# Altium project PowerManagement_neg5V.PrjPcb
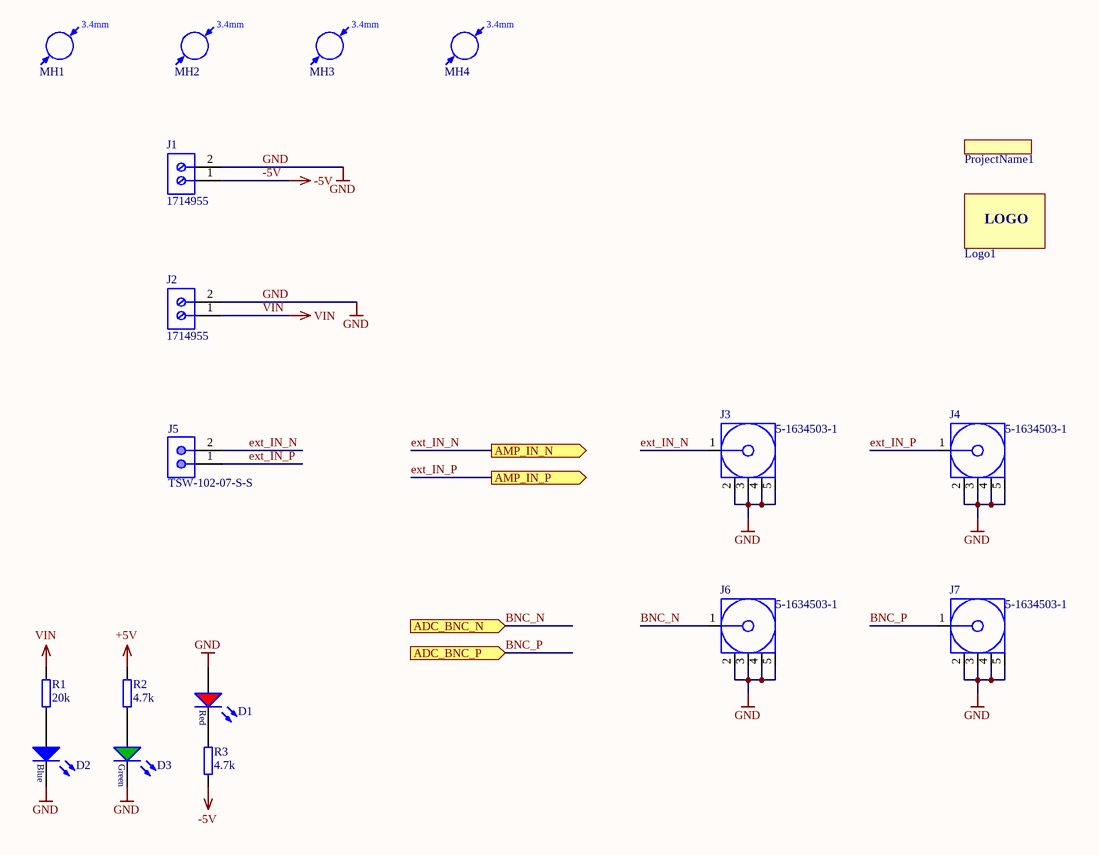
[diagram p0: PCBdesign.SchDoc]
Author: S.Lukas; Date: 06/20; ProjectAuthor: Simon Lukas; ProjectName: Power Supply -5V; ProjectRevision: 1v03
3 sheets, 107 parts. Net scope: flat (ports and power ports of the same name join across sheets).
Board file: PowerManagement_neg5V.PcbDoc
Sheets:
  PCBdesign.SchDoc
  PowerSupply.SchDoc
  Amplifier.SchDoc

## Sheet PCBdesign.SchDoc
size A4; Author: Eyke Liegmann; CompanyName: Technische Universität München; Address1: Arcisstr. 21; Address2: 80333 München; Address3: GERMANY; SheetNumber: 1; SheetTotal: 3; CompanyName2: TU München

### Parts
D1  150060RS75000  [WL-SMCW_0603]  (value not drawn)
D2  150060BS75000  [WL-SMCW_0603]  (value not drawn)
D3  150060GS75000  [WL-SMCW_0603]  (value not drawn)
J1  1714955  [PHOE-1714955_V]
J2  1714955  [PHOE-1714955_V]
J3  5-1634503-1  [TECO-5-1634503-1_V]
J4  5-1634503-1  [TECO-5-1634503-1_V]
J5  TSW-102-07-S-S  [SMTC-TSW-102-07-S-S]
J6  5-1634503-1  [TECO-5-1634503-1_V]
J7  5-1634503-1  [TECO-5-1634503-1_V]
Logo1  (no value)  [LOGO_Tum]
MH1  mounting hole 3,4mm  [MH_3.4]  (value not drawn)
MH2  mounting hole 3,4mm  [MH_3.4]  (value not drawn)
MH3  mounting hole 3,4mm  [MH_3.4]  (value not drawn)
MH4  mounting hole 3,4mm  [MH_3.4]  (value not drawn)
ProjectName1  Project Name, Rev  [ID_ProjectRev]  (value not drawn)  (no BOM)
R1  20k  [RESC1608X06N]
R2  4.7k  [RESC1608X06N]
R3  4.7k  [RESC1608X06N]

### Ports
ADC_BNC_N (in), ADC_BNC_P (in), AMP_IN_N (out), AMP_IN_P (out)

### Nets
+5V: R2.2
-5V: J1.1 R3.1
GND: D1.2(A) D2.1(K) D3.1(K) J1.2 J2.2 J3.2 J3.3 J3.4 J3.5 J4.2 J4.3 J4.4 J4.5 J6.2 J6.3 J6.4 J6.5 J7.2 J7.3 J7.4 J7.5
VIN: J2.1 R1.2  [project net conv_N]
BNC_N: J6.1 ; port ADC_BNC_N  [project net ADC_IN_N]
BNC_P: J7.1 ; port ADC_BNC_P  [project net ADC_IN_P]
ext_IN_N: J3.1 J5.2 ; port AMP_IN_N
ext_IN_P: J4.1 J5.1 ; port AMP_IN_P
NetD1_1: D1.1(K) R3.2
NetD2_2: D2.2(A) R1.1
NetD3_2: D3.2(A) R2.1

### Notes on the sheet
- Title
- Size:
- Date:
- A4
- Revision:
- Time:
- Sheet
- of
- Author:
- Project:
- (in symbol Logos) LOGO
- (in symbol Mounting Hole) 3.4mm

### Library data of the parts
D1 = LED_Red_0603: WL-SMCW SMD Mono-color Chip LED Waterclear, size 0603, Red, 2 V, 140°; Forward Voltage: 2 V; Luminous Intensity: 250 mcd; Peak Wavelength: 630 nm; Dominant Wavelength: 625 nm; MF: Wuerth Elektronik; Published Date: Sep. 2017; ComponentLink1Description: Manufacturer; ComponentLink1URL: http://www.we-online.de; ComponentLink2Description: Datasheet; ComponentLink2URL: http://katalog.we-online.com/led/datasheet/150060RS75000.pdf; MPN: 150060RS75000; Size: 0603; Viewing Angle: 140°; Emitting Color: Red; Value: 150060RS75000; Package: 0603; Created: 2018_09_06_AGeiger; Supplier 1: Farnell; Supplier Part Number 1: 2322071; Supplier 2: Mouser; Supplier Part Number 2: 710-150060RS75000; Supplier 3: Digi-Key; Supplier Part Number 3: 732-4978-1-ND
D2 = LED_Blue_0603: WL-SMCW SMD Mono-color Chip LED Waterclear, size 0603, Blue, 3.2 V, 140°; Forward Voltage: 3.2 V; Luminous Intensity: 145 mcd; Peak Wavelength: 465 nm; Dominant Wavelength: 470 nm; MF: Wuerth Elektronik; Published Date: Sep. 2017; ComponentLink1Description: Manufacturer; ComponentLink1URL: http://www.we-online.de; ComponentLink2Description: Datasheet; ComponentLink2URL: http://katalog.we-online.com/led/datasheet/150060BS75000.pdf; MPN: 150060BS75000; Size: 0603; Viewing Angle: 140°; Emitting Color: Blue; Value: 150060BS75000; Package: 0603; Created: 2018_09_06_AGeiger; Supplier 1: Farnell; Supplier Part Number 1: 2322069; Supplier 2: Mouser; Supplier Part Number 2: 710-150060BS75000; Supplier 3: Digi-Key; Supplier Part Number 3: 732-4966-1-ND
D3 = LED_Green_0603: WL-SMCW SMD Mono-color Chip LED Waterclear, size 0603, Green, 3.2 V, 140°; Forward Voltage: 3.2 V; Luminous Intensity: 430 mcd; Peak Wavelength: 515 nm; Dominant Wavelength: 520 nm; MF: Wuerth Elektronik; Published Date: Sep. 2017; ComponentLink1Description: Manufacturer; ComponentLink1URL: http://www.we-online.de; ComponentLink2Description: Datasheet; ComponentLink2URL: http://katalog.we-online.com/led/datasheet/150060GS75000.pdf; MPN: 150060GS75000; Size: 0603; Viewing Angle: 140°; Emitting Color: Green; Value: 150060GS75000; Package: 0603; Created: 2018_09_06_AGeiger; Supplier 1: Farnell; Supplier Part Number 1: 2322070; Supplier 2: Mouser; Supplier Part Number 2: 710-150060GS75000; Supplier 3: Digi-Key; Supplier Part Number 3: 732-4971-1-ND
J1 J2 = 1714955: Conn Terminal Blocks 2 POS 6.35mm Solder ST Thru-Hole 32A; Manufacturer: Phoenix Contact; Max Supply Voltage: 500V; Voltage Rating: 630V; Number of Poles: 2; Number of Levels: 1; Current: 30A; Voltage: 300V; Gender: Male; Connector Type: PCB,Terminal Block; Wire Gauge (Max): 24AWG; Wire Gauge (Min): 10AWG; Stripping Length: 8mm; Approvals: UL,CSA,cULus; Supplier 1: Mouser; Manufacturer Part Number: 1714955; RoHS: Yes; Category: Terminal Blocks; Stock 1: 477; Mount: Through Hole; Number of Pins: 2; Weight: 0.197534oz; Color: Green; Housing Material: Polyamide; Housing Color: Green; Material: Polyamide; Insulation Material: Nylon; Contact Material: Tin; Package Quantity: 50; Packaging: Bulk; Termination: Screw; Max Current Rating: 32A; Current Rating: 32A; Number of Rows: 1; Orientation: Straight; Number of Positions Per Level: 2; Number of Positions: 2; Number of Contacts: 2; Number of Circuits: 2; Length: 12.7mm; Height: 26.6mm; Width: 26.6mm; Pitch: 6.35mm; Depth: 12.5mm; Wire/Cable Gauge: 24AWG; Radiation Hardening: No; Lead Free: Lead Free; Flammability Rating: UL94 V-0; REACH SVHC: No SVHC; ComponentLink1URL: https://datasheet.ciiva.com/16071/1714955-16071953.pdf?src-supplier=Onlinecomponents.com; ComponentLink1Description: https://datasheet.ciiva.com/16071/1714955-16071953.pdf?src-supplier=Onlinecomponents.com; ComponentLink2URL: https://datasheet.ciiva.com/824/1714955-824307.pdf?src-supplier=Digi-Key; ComponentLink2Description: https://datasheet.ciiva.com/824/1714955-824307.pdf?src-supplier=Digi-Key; ComponentLink3URL: https://datasheet.ciiva.com/1120/100944-1120389.pdf?src-supplier=Farnell; ComponentLink3Description: https://datasheet.ciiva.com/1120/100944-1120389.pdf?src-supplier=Farnell; ComponentLink4URL: https://datasheet.ciiva.com/15169/getdatasheetpartid-177883-15169653.pdf?src-supplier=Verical; ComponentLink4Description: https://datasheet.ciiva.com/15169/getdatasheetpartid-177883-15169653.pdf?src-supplier=Verical; ComponentLink5URL: https://datasheet.ciiva.com/1118/100944-1118422.pdf?src-supplier=Element14; ComponentLink5Description: https://datasheet.ciiva.com/1118/100944-1118422.pdf?src-supplier=Element14; ComponentLink6URL: https://datasheet.ciiva.com/14607/70054427-14607514.pdf?src-supplier=Allied+Electronics; ComponentLink6Description: https://datasheet.ciiva.com/14607/70054427-14607514.pdf?src-supplier=Allied+Electronics; ComponentLink7URL: https://datasheet.ciiva.com/29218/744545-da-01-en-printklemme-mkds-5-2-6-35-29218282.pdf?src-supplier=Conrad; ComponentLink7Description: https://datasheet.ciiva.com/29218/744545-da-01-en-printklemme-mkds-5-2-6-35-29218282.pdf?src-supplier=Conrad; Supplier Part Number 1: 651-1714955
J3 J4 J6 J7 = 5-1634503-1: BNC Str PCB Skt 50Ohm Nickel Pltd; Manufacturer: TE Connectivity; Dielectric Material: Polymethylpentene; Body Material: Zinc; Impedance: 50R; Frequency: 4GHz; Gender: Female; Connector Type: BNC,Jack; Insulation Resistance: 5GR; Number of Positions: 1; PCB Mount Retention: With; Sealable: No (Without); Connector System: Cable-to-Board; Polarity: Standard,Normal; PCB Thickness: 0.126inch; Tail Length: 0.177inch; Supplier 1: Mouser; Manufacturer Part Number: 5-1634503-1; RoHS: Yes; Category: RF / Coaxial Connectors; Stock 1: 5615; Mount: Through Hole,PCB; Contact Material: Bronze; Contact Plating: Gold; Insulation Material: Polymethylpentene; Body Plating: Nickel; Min Operating Temperature: -67°C; Max Operating Temperature: 185°C; Orientation: Straight; Termination: Solder; Packaging: Box; Package Quantity: 100; Fastening Type: Bayonet; Max Frequency: 4GHz; Length: 13.7mm; Depth: 11mm; Radiation Hardening: No; ELV: Compliant; REACH SVHC: No SVHC; ComponentLink1URL: https://datasheet.ciiva.com/9421/eng-cd-1634503-c-9421987.pdf?src-supplier=Avnet; ComponentLink1Description: https://datasheet.ciiva.com/9421/eng-cd-1634503-c-9421987.pdf?src-supplier=Avnet; ComponentLink2URL: https://datasheet.ciiva.com/642/eng-cd-1634503-e-642757.pdf?src-supplier=Digi-Key; ComponentLink2Description: https://datasheet.ciiva.com/642/eng-cd-1634503-e-642757.pdf?src-supplier=Digi-Key; ComponentLink3URL: https://datasheet.ciiva.com/30141/eng-cd-1634503-c-30141260.pdf?src-supplier=Onlinecomponents.com; ComponentLink3Description: https://datasheet.ciiva.com/30141/eng-cd-1634503-c-30141260.pdf?src-supplier=Onlinecomponents.com; ComponentLink4URL: https://datasheet.ciiva.com/11762/0900766b806ccb99-11762655.pdf?src-supplier=RSComponents; ComponentLink4Description: https://datasheet.ciiva.com/11762/0900766b806ccb99-11762655.pdf?src-supplier=RSComponents; ComponentLink5URL: https://datasheet.ciiva.com/1448/1663562-1448576.pdf?src-supplier=Element14; ComponentLink5Description: https://datasheet.ciiva.com/1448/1663562-1448576.pdf?src-supplier=Element14; ComponentLink6URL: https://datasheet.ciiva.com/16652/eng-cd-1634503-c-16652893.pdf?src-supplier=Avnet+Europe; ComponentLink6Description: https://datasheet.ciiva.com/16652/eng-cd-1634503-c-16652893.pdf?src-supplier=Avnet+Europe; Supplier Part Number 1: 571-5-1634503-1
J5 = TSW-102-07-S-S: SAMTEC         TSW-102-07-S-S             CONNECTOR, HEADER, 2 POSITION, 1ROW, 2.54MM; Number of Contacts: 2; Gender: Male; Connector Type: Male Pin; Max Current Rating: 7.6A; Max Voltage Rating (AC): 550V; Supplier 1: Mouser; Manufacturer: Samtec; Manufacturer Part Number: TSW-102-07-S-S; RoHS: Yes; Category: Headers and Wire Housings; Stock 1: 9923; Mount: Through Hole; Contact Material: Bronze; Housing Material: Polyester; Contact Plating: Gold; Color: Black; Housing Color: Black; Min Operating Temperature: -55°C; Max Operating Temperature: 125°C; Packaging: Bulk; Number of Rows: 1; Termination: Solder; Number of Positions: 2; Orientation: Straight; Package Quantity: 1; Length: 5.08mm; Pitch: 2.54mm; Depth: 2.54mm; Contact Mating Length: 0.23inch; Width: 2.54mm; Radiation Hardening: No; REACH SVHC: No SVHC; Lead Free: Lead Free; ComponentLink1URL: https://datasheet.ciiva.com/28366/1796313-28366300.pdf?src-supplier=Element14; ComponentLink1Description: https://datasheet.ciiva.com/28366/1796313-28366300.pdf?src-supplier=Element14; ComponentLink2URL: https://datasheet.ciiva.com/16734/htsw-th-16734222.pdf?src-supplier=Avnet+Europe; ComponentLink2Description: https://datasheet.ciiva.com/16734/htsw-th-16734222.pdf?src-supplier=Avnet+Europe; Supplier Part Number 1: 200-TSW10207SS
Logo1 = Logos
MH1-MH4 = Mounting Hole: Non plated through hole, 3.4mm
ProjectName1 = ID_ProjectRev: Project Name and Revision Number; Created: 2018_11_23_AGeiger; Value: Project Name, Rev
R1 = R_0603: MPN: Vishay / Dale; MF: CRCW060320K0JNEAC; Value: 20k; Supplier 1: Mouser; Supplier Part Number 1: 71-CRCW060320K0JNEAC; Package: 0603
R2 R3 = R_0603: MPN: CRCW06034K70JNEAC; MF: Vishay / Dale; Value: 4.7k; Supplier 1: Mouser; Supplier Part Number 1: 71-CRCW06034K70JNEAC; Package: 0603

## Sheet PowerSupply.SchDoc
size A4; Author: Eyke Liegmann; CompanyName: Technische Universität München; Address1: Arcisstr. 21; Address2: 80333 München; Address3: GERMANY; SheetNumber: 2; SheetTotal: 3; CompanyName2: TU München
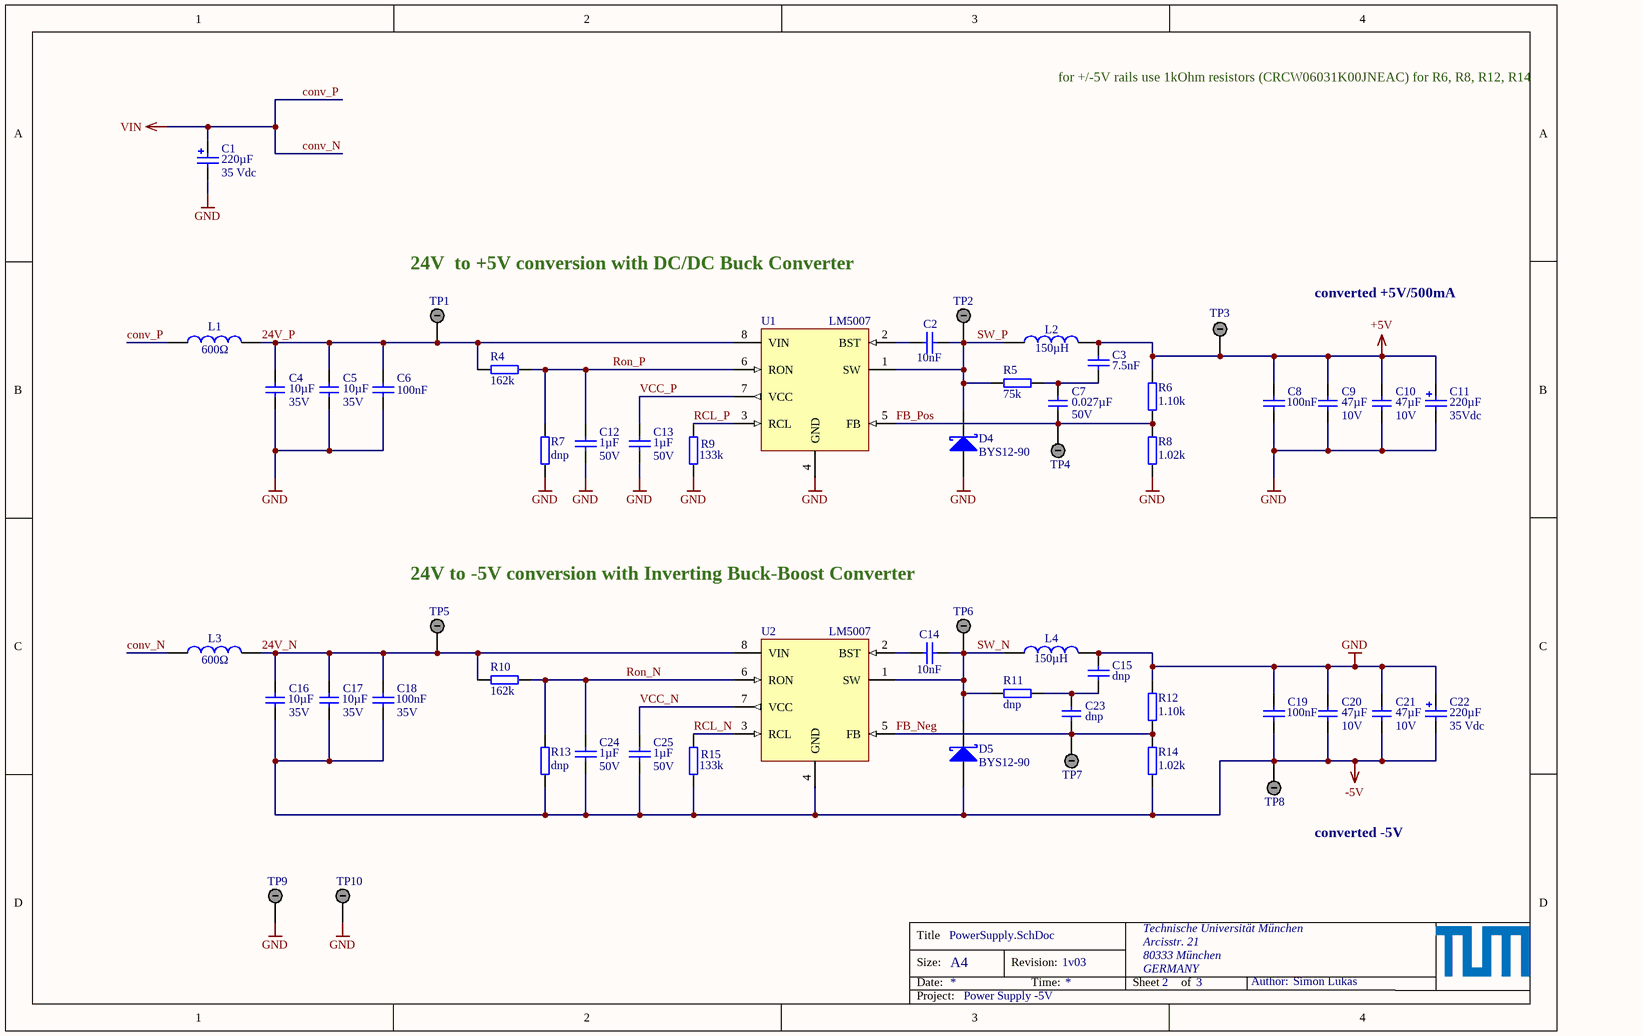
[diagram p1: PowerSupply.SchDoc]

### Parts
C1  220µF  Voltage: 35 Vdc  [WCAP-ATG5_8x11.5x3.5]
C2  10nF  [CAPC1608X07N]
C3  7.5nF  [CAPC1608X07N]
C4  10µF  Voltage: 35V  [C_1206]
C5  10µF  Voltage: 35V  [C_1206]
C6  100nF  [CAPC1608X07N]
C7  0.027µF  Voltage: 50V  [C_1206]
C8  100nF  [CAPC1608X07N]
C9  47µF  Voltage: 10V  [C_1206]
C10  47µF  Voltage: 10V  [C_1206]
C11  220µF  Voltage: 35Vdc  [WCAP-ATG5_8x11.5x3.5]
C12  1µF  Voltage: 50V  [CAPC1608X07N]
C13  1µF  Voltage: 50V  [CAPC1608X07N]
C14  10nF  [CAPC1608X07N]
C15  dnp  [CAPC1608X07N]
C16  10µF  Voltage: 35V  [C_1206]
C17  10µF  Voltage: 35V  [C_1206]
C18  100nF  Voltage: 35V  [CAPC1608X07N]
C19  100nF  [CAPC1608X07N]
C20  47µF  Voltage: 10V  [C_1206]
C21  47µF  Voltage: 10V  [C_1206]
C22  220µF  Voltage: 35 Vdc  [WCAP-ATG5_8x11.5x3.5]
C23  dnp  [C_1206]
C24  1µF  Voltage: 50V  [CAPC1608X07N]
C25  1µF  Voltage: 50V  [CAPC1608X07N]
D4  BYS12-90  [DIOM4227X23N]
D5  BYS12-90  [DIOM4227X23N]
L1  600Ω  [WE-CBF_0805_High Current]
L2  150µH  [SMT_inductor_1050_Performance]
L3  600Ω  [WE-CBF_0805_High Current]
L4  150µH  [SMT_inductor_1050_Performance]
R4  162k  [RESC1608X06N]
R5  75k  [RESC1608X06N]
R6  1.10k  [RESC1608X06N]
R7  dnp  [RESC1608X06N]
R8  1.02k  [RESC1608X06N]
R9  133k  [RESC1608X06N]
R10  162k  [RESC1608X06N]
R11  dnp  [RESC1608X06N]
R12  1.10k  [RESC1608X06N]
R13  dnp  [RESC1608X06N]
R14  1.02k  [RESC1608X06N]
R15  133k  [RESC1608X06N]
TP1  24V_P  [TP_5006]  (value not drawn)
TP2  SW_P  [TP_5006]  (value not drawn)
TP3  +5V  [TP_5006]  (value not drawn)
TP4  FB_P  [TP_5006]  (value not drawn)
TP5  24V_N  [TP_5006]  (value not drawn)
TP6  SW_N  [TP_5006]  (value not drawn)
TP7  FB_N  [TP_5006]  (value not drawn)
TP8  -5V  [TP_5006]  (value not drawn)
TP9  GND  [TP_5006]  (value not drawn)
TP10  GND  [TP_5006]  (value not drawn)
U1  LM5007  [TSOP65P490X110-8N]
U2  LM5007  [TSOP65P490X110-8N]

### Nets
+5V: C3.1 C8.2 C9.2 C10.2 C11.1(P) L2.2 R6.2 TP3.1
-5V: C16.1 C17.1 C18.2 C19.1 C20.1 C21.1 C22.2(N) C24.2 C25.2 D5.2(A) R13.1 R14.2 R15.1 TP8.1 U2.4(GND)
conv_N: C1.1(P) L1.1 L3.1  [also labelled conv_P, VIN]
GND: C1.2(N) C4.1 C5.1 C6.2 C8.1 C9.1 C10.1 C11.2(N) C12.2 C13.2 C15.1 C19.2 C20.2 C21.2 C22.1(P) D4.2(A) L4.2 R7.1 R8.1 R9.1 R12.1 TP9.1 TP10.1 U1.4(GND)
24V_N: C16.2 C17.2 C18.1 L3.2 R10.2 TP5.1 U2.8(VIN)
24V_P: C4.2 C5.2 C6.1 L1.2 R4.1 TP1.1 U1.8(VIN)
FB_Neg: C23.2 R12.2 R14.1 TP7.1 U2.5(FB)
FB_Pos: C7.1 R6.1 R8.2 TP4.1 U1.5(FB)
RCL_N: R15.2 U2.3(RCL)
RCL_P: R9.2 U1.3(RCL)
Ron_N: C24.1 R10.1 R13.2 U2.6(RON)
Ron_P: C12.1 R4.2 R7.2 U1.6(RON)
SW_N: C14.1 D5.1(K) L4.1 R11.2 TP6.1 U2.1(SW)
SW_P: C2.2 D4.1(K) L2.1 R5.1 TP2.1 U1.1(SW)
VCC_N: C25.1 U2.7(VCC)
VCC_P: C13.1 U1.7(VCC)
NetC2_1: C2.1 U1.2(BST)
NetC3_2: C3.2 C7.2 R5.2
NetC14_2: C14.2 U2.2(BST)
NetC15_2: C15.2 C23.1 R11.1

### Notes on the sheet
- for +/-5V rails use 1kOhm resistors (CRCW06031K00JNEAC) for R6, R8, R12, R14
- (near TP1) 24V  to +5V conversion with DC/DC Buck Converter
- converted +5V/500mA
- 24V to -5V conversion with Inverting Buck-Boost Converter
- converted -5V
- Title
- Size:
- Date:
- A4
- Revision:
- Time:
- Sheet
- of
- Author:
- Project:

### Library data of the parts
C1 C11 C22 = 860020574012: WCAP-ATG5 Aluminum Electrolytic Capacitors, 8x11.5mm, 35 Vdc, 220 uF; MF: Würth Elektronik; ComponentLink1Description: Manufacturer; ComponentLink1URL: http://www.we-online.de; ComponentLink2Description: Datasheet; ComponentLink2URL: http://katalog.we-online.com/pbs/datasheet/860020574012.pdf; Part Number: 860020574012; Size: 8x11.5mm; Life Cycle: 2000h; Operating Temperature: -40 °C up to +105 °C; Value: 220 µF; MPN: 860020574012; Supplier 1: Mouser; Supplier Part Number 1: 710-860020574012
C2 C14 = Cap_0603: MPN: 885012206065; MF: Würth Elektronik; Voltage: 25V; Dielectric: X7R; Value: 10nF; Supplier 1: Mouser; Supplier 2: Digi-Key; Supplier Part Number 1: 710-885012206065; Supplier Part Number 2: 732-7983-1-ND; Package: 0603
C3 = Cap_0603: MPN: C0603C752J3GACTU; MF: KEMET; Voltage: 25V; Dielectric: C0G; Tolerance: 5%; Value: 7.5nF; Supplier 1: Mouser; Supplier 2: *; Supplier Part Number 1: 80-C0603C752J3GACTU; Supplier Part Number 2: *; Package: 0603
C4 C5 C16 C17 = C_1206: Capacitor 1206; MPN: GRT31CC8YA106KE01L; Tolerance: 10%; MF: Murata Electronics; Dielectric: X6S; Package: 1206; Value: 10µF; Supplier 1: Mouser; Supplier Part Number 1: 81-GRT31CC8YA106KE1L
C6 = Cap_0603: MPN: 885012206071; MF: Würth Elektronik; Voltage: 25V; Dielectric: X7R; Value: 100nF; Supplier 1: Mouser; Supplier 2: Digi-Key; Supplier Part Number 1: 710-885012206071; Supplier Part Number 2: 732-7989-1-ND; Package: 0603
C7 = C_1206: Capacitor 1206; MPN: GRM3195C1H273JA01D; Tolerance: 5%; MF: Murata Electronics; Dielectric: C0G; Package: 1206; Value: 0.027µF; Supplier 1: Mouser; Supplier Part Number 1: 81-GRM315C1H273JA01D
C8 C19 = Cap_0603: MPN: 885012206071; MF: Würth Elektronik; Voltage: 25V; Dielectric: X7R; Tolerance: 10%; Value: 100nF; Supplier 1: Mouser; Supplier 2: *; Supplier Part Number 1: 710-885012206071; Supplier Part Number 2: *; Package: 0603
C9 C10 C20 C21 = C_1206: Capacitor 1206; MPN: GRM31CR61A476ME15L; Tolerance: 20%; MF: Murata Electronics; Dielectric: X5R; Package: 1206; Value: 47µF; Supplier 1: Mouser; Supplier Part Number 1: 81-GRM31CR61A476ME5L
C12 C13 C24 C25 = Cap_0603: MPN: GRT188R61H105KE13D; MF: Murata Electronics; Dielectric: X5R; Value: 1µF; Supplier 1: Mouser; Supplier 2: Digi-Key; Supplier Part Number 1: 81-GRT188R61H105KE3D; Supplier Part Number 2: 490-12330-1-ND; Package: 0603
C15 = Cap_0603: MPN: C0603C752J3GACTU; possibleValue: 7.5nF; MF: KEMET; Voltage: 25V; Dielectric: C0G; Tolerance: 5%; Supplier 1: Mouser; Supplier 2: *; Supplier Part Number 1: 80-C0603C752J3GACTU; Supplier Part Number 2: *; Package: 0603; Value: dnp
C18 = Cap_0603: MPN: GMK107B7104KAHT; MF: Taiyo Yuden; Tolerance: 10%; Dielectric: X7R; Value: 100nF; Supplier 1: Mouser; Supplier 2: Digi-Key; Supplier Part Number 1: 963-GMK107B7104KAHT; Supplier Part Number 2: 587-3354-1-ND; Package: 0603
C23 = C_1206: Capacitor 1206; MPN: GRM3195C1H273JA01D; possibleValue: 0.027µF; Tolerance: 5%; MF: Murata Electronics; Dielectric: C0G; Voltage: 50V; Package: 1206; Supplier 1: Mouser; Supplier Part Number 1: 81-GRM315C1H273JA01D; Value: dnp
D4 D5 = BYS12-90: Schottky Diode; MPN: BYS12-90-E3/TR3; MF: Vishay; Forward Voltage: 750mV; Reverse Voltage: 90V; Rated Current: 1.5A; Package: DO-214AC; Supplier 1: Farnell; Supplier 2: Mouser; Supplier 3: Digi-Key; Supplier Part Number 1: 2889144; Supplier Part Number 2: 625-BYS12-90-E3/TR3; Supplier Part Number 3: BYS12-90-E3/GICT-ND
L1 L3 = WE-CBF, 742792040: WE-CBF SMD EMI Suppression Ferrite Bead, 0805, 600Ω; MF: Würth Elektronik; Type: High Current; ComponentLink1Description: Manufacturer; ComponentLink1URL: http://www.we-online.de; ComponentLink2Description: Datasheet; ComponentLink2URL: http://katalog.we-online.de/pbs/datasheet/742792040.pdf; MPN: 742792040; Value: 600Ω; Size: 0805; Supplier 1: Farnell; Supplier 2: Mouser; Supplier 3: Digi-Key; Supplier Part Number 2: 710-742792040; Supplier Part Number 3: 732-1620-1-ND
  L1: Supplier Part Number 1: 2761567
  L3: Supplier Part Number 1: 1635735
L2 L4 = B82464G4154M: SMT power Inductor, 150uH, 320m DRC; MF: EPCOS / TDK; Rated Current: 0.85 A; Tolerance: 20%; MPN: B82464G4154M; Supplier 1: Mouser; Supplier Part Number 1: 871-B82464G4154M; Value: 150µH; DCR: 320m
R4 R10 = R_0603: MPN: CR0603-FX-1623ELF; MF: Bourns; Value: 162k; Supplier 1: Mouser; Supplier Part Number 1: 652-CR0603-FX1623ELF; Package: 0603
R5 = R_0603: MPN: AC0603FR-1375KL; MF: Yageo; Value: 75k; Supplier 1: Mouser; Supplier Part Number 1: 603-AC0603FR-1375KL; Package: 0603
R6 R12 = R_0603: MPN: CRCW06031K10JNEAC; MF: Vishay / Dale; Tolerance: 5%; Value: 1.10k; Supplier 1: Mouser; Supplier Part Number 1: 71-CRCW06031K10JNEAC; Package: 0603
R7 R13 = R_0603: Value: dnp; Package: 0603
R8 R14 = R_0603: MPN: CR0603-FX-1021ELF; MF: Bourns; Tolerance: 1%; Value: 1.02k; Supplier 1: Mouser; Supplier Part Number 1: 652-CR0603FX-1021ELF; Package: 0603
R9 R15 = R_0603: MPN: CR0603-FX-1333ELF; MF: Bourns; Value: 133k; Supplier 1: Mouser; Supplier Part Number 1: 652-CR0603FX-1333ELF; Package: 0603
R11 = R_0603: MPN: AC0603FR-1375KL; possibleValue: 75k; MF: Yageo; Supplier 1: Mouser; Supplier Part Number 1: 603-AC0603FR-1375KL; Package: 0603; Value: dnp
TP1-TP10 = 5006: Test Point;  Compact;  THM;  PC;  .350 L;  .125 OD;  Heat Resistant Nylon 46;  Black; Manufacturer: Keystone Electronics; Body Material: PBT; Plating: Silver; Number of Ports: 1; Outside Diameter: 3.18mm; Inside Diameter: 1.78mm; Hole Diameter: 1.6mm; Supplier 1: Mouser; Manufacturer Part Number: 5006; RoHS: Yes; Category: Connectors; Stock 1: 203116; Mount: PCB,Through Hole; Material: Nylon,Bronze,Silver; Contact Material: Bronze; Contact Plating: Tin,Silver; Color: Black; Housing Color: Black; Package Quantity: 100; Packaging: Bulk; Orientation: Straight; Length: 8.89mm; Height: 0.35inch; Lead Free: Lead Free; REACH SVHC: No SVHC; Flammability Rating: UL94 V-0; ComponentLink1URL: https://datasheet.ciiva.com/1123/m60-2p60-1123808.pdf?src-supplier=Newark; ComponentLink1Description: https://datasheet.ciiva.com/1123/m60-2p60-1123808.pdf?src-supplier=Newark; ComponentLink2URL: https://datasheet.ciiva.com/1454/1718283-1454829.pdf?src-supplier=Element14; ComponentLink2Description: https://datasheet.ciiva.com/1454/1718283-1454829.pdf?src-supplier=Element14; ComponentLink3URL: https://datasheet.ciiva.com/11744/0900766b8009b7c7-11744947.pdf?src-supplier=RSComponents; ComponentLink3Description: https://datasheet.ciiva.com/11744/0900766b8009b7c7-11744947.pdf?src-supplier=RSComponents; ComponentLink4URL: https://datasheet.ciiva.com/2917/m60-2p60-2917629.pdf?src-supplier=Digi-Key; ComponentLink4Description: https://datasheet.ciiva.com/2917/m60-2p60-2917629.pdf?src-supplier=Digi-Key; ComponentLink5URL: https://datasheet.ciiva.com/16883/70182825-16883963.pdf?src-supplier=Allied+Electronics; ComponentLink5Description: https://datasheet.ciiva.com/16883/70182825-16883963.pdf?src-supplier=Allied+Electronics; Supplier Part Number 1: 534-5006
U1 U2 = LM5007: Buck Converter, 9-75Vin, 2.5-73Vout; MPN: LM5007MM/NOPB; MF: Texas Instruments; Supplier 1: Farnell; Supplier 2: Mouser; Supplier 3: Digi-Key; Supplier Part Number 1: 3007210; Supplier Part Number 2: 926-LM5007MM/NOPB; Supplier Part Number 3: 296-LM5007MM/NOPBCT-ND; Package: VSSOP-8

## Sheet Amplifier.SchDoc
size A4; Author: Eyke Liegmann; CompanyName: Technische Universität München; Address1: Arcisstr. 21; Address2: 80333 München; Address3: GERMANY; SheetNumber: 3; SheetTotal: 3; CompanyName2: TU München
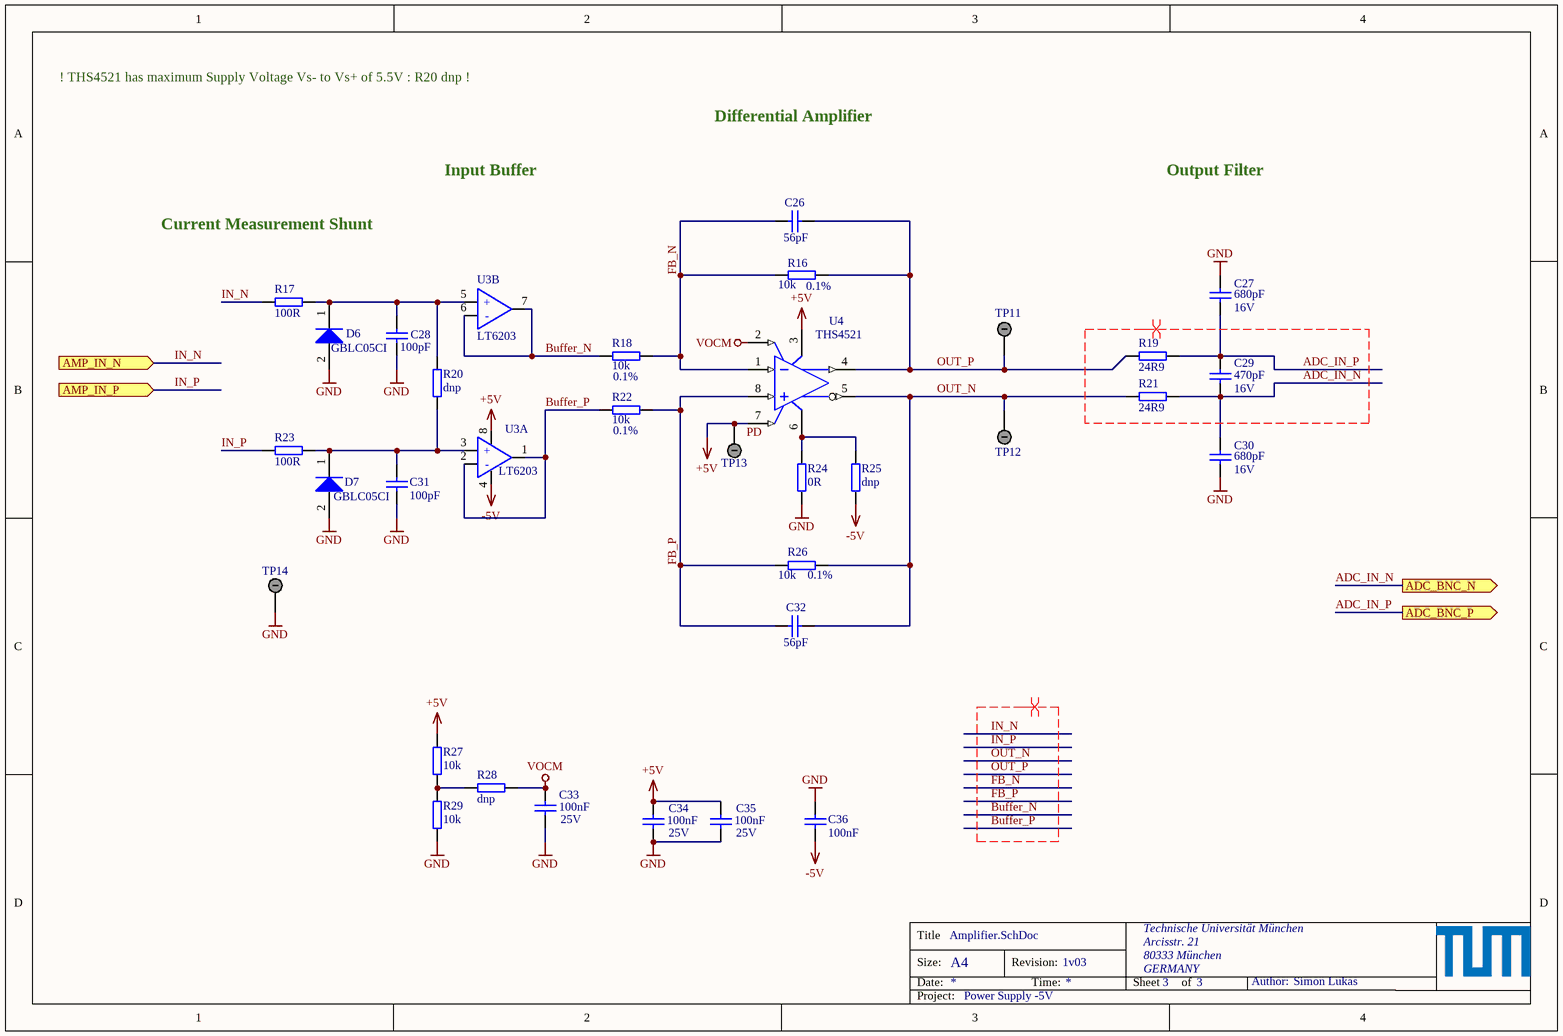
[diagram p2: Amplifier.SchDoc]

### Parts
C26  56pF  [CAPC1608X07N]
C27  680pF  Voltage: 16V  [CAPC1608X07N]
C28  100pF  [CAPC1608X07N]
C29  470pF  Voltage: 16V  [CAPC1608X07N]
C30  680pF  Voltage: 16V  [CAPC1608X07N]
C31  100pF  [CAPC1608X07N]
C32  56pF  [CAPC1608X07N]
C33  100nF  Voltage: 25V  [CAPC1608X07N]
C34  100nF  Voltage: 25V  [CAPC1608X07N]
C35  100nF  Voltage: 25V  [CAPC1608X07N]
C36  100nF  [CAPC1608X07N]
D6  GBLC05CI  [SOD-323_SuppressorDiode]
D7  GBLC05CI  [SOD-323_SuppressorDiode]
R16  10k  Tolerance: 0.1%  [RESC1608X06N]
R17  100R  [RESC1608X06N]
R18  10k  Tolerance: 0.1%  [RESC1608X06N]
R19  24R9  [RESC1608X06N]
R20  dnp  [RESC3216X65N]
R21  24R9  [RESC1608X06N]
R22  10k  Tolerance: 0.1%  [RESC1608X06N]
R23  100R  [RESC1608X06N]
R24  0R  [RESC1608X06N]
R25  dnp  [RESC1608X06N]
R26  10k  Tolerance: 0.1%  [RESC1608X06N]
R27  10k  [RESC1608X06N]
R28  dnp  [RESC1608X06N]
R29  10k  [RESC1608X06N]
TP11  AMP+  [TP_5006]  (value not drawn)
TP12  AMP-  [TP_5006]  (value not drawn)
TP13  PD  [TP_5006]  (value not drawn)
TP14  GND  [TP_5006]  (value not drawn)
U3  LT6203  [MSOP8_3x3-8N]  (parts A,B of 2)
U4  THS4521  [DGK0008A_N]

### Ports
ADC_BNC_N (out), ADC_BNC_P (out), AMP_IN_N (in), AMP_IN_P (in)

### Nets
+5V: C34.1 C35.1 R27.1 TP13.1 U3.8 U4.3(VS+) U4.7(~{PD})
-5V: C36.2 R25.1 U3.4
GND: C27.1 C28.2 C30.2 C31.2 C33.2 C34.2 C35.2 C36.1 D6.2(A) D7.2(A) R24.1 R29.2 TP14.1
VOCM: C33.1 R28.1 U4.2(VOCM)
ADC_IN_N: C29.2 C30.1 R21.2 ; port ADC_BNC_N
ADC_IN_P: C27.2 C29.1 R19.2 ; port ADC_BNC_P
Buffer_N: R18.1 U3.6(-) U3.7
Buffer_P: R22.1 U3.1 U3.2(-)
FB_N: C26.1 R16.1 R18.2 U4.1(VIN-)
FB_P: C32.1 R22.2 R26.1 U4.8(VIN+)
IN_N: R17.1 ; port AMP_IN_N  [project net ext_IN_N]
IN_P: R23.1 ; port AMP_IN_P  [project net ext_IN_P]
OUT_N: C32.2 R21.1 R26.2 TP12.1 U4.5(VOUT-)
OUT_P: C26.2 R16.2 R19.1 TP11.1 U4.4(VOUT+)
NetC28_1: C28.1 D6.1(K) R17.2 R20.2 U3.5(+)
NetC31_1: C31.1 D7.1(K) R20.1 R23.2 U3.3(+)
NetR24_2: R24.2 R25.2 U4.6(VS-)
NetR27_2: R27.2 R28.2 R29.1

### Layout directives
differential pair: ADC_IN_N, ADC_IN_P, Buffer_N, Buffer_P, FB_N, FB_P, IN_N, IN_P, OUT_N, OUT_P

### Notes on the sheet
- ! THS4521 has maximum Supply Voltage Vs- to Vs+ of 5.5V : R20 dnp !
- Input Buffer
- Differential Amplifier
- Output Filter
- Current Measurement Shunt
- Labels drawn without touching a wire or pin: PD
- Title
- Size:
- Date:
- A4
- Revision:
- Time:
- Sheet
- of
- Author:
- Project:

### Library data of the parts
C26 C32 = Cap_0603: MPN: VJ0603A560JXACW1BC; MF: Vishay; Voltage: 50V; Dielectric: C0G; Value: 56pF; Supplier 1: Mouser; Supplier 2: *; Supplier Part Number 1: 77-VJ0603A560JXACBC; Supplier Part Number 2: *; Package: 0603
C27 C30 = Cap_0603: MPN: VJ0603A681GXJCW1BC; MF: Vishay; Dielectric: C0G; Value: 680pF; Supplier 1: Mouser; Supplier 2: *; Supplier Part Number 1: 77-VJ0603A681GXJCBC; Supplier Part Number 2: *; Package: 0603
C28 C31 = Cap_0603: MPN: 885012006057; MF: Würth Elektronik; Voltage: 50V; Value: 100pF; Supplier 1: Mouser; Supplier 2: *; Supplier Part Number 1: 710-885012006057; Supplier Part Number 2: *
C29 = Cap_0603: MPN: VJ0603A471JXJCW1BC; MF: Vishay; Dielectric: C0G; Value: 470pF; Supplier 1: Mouser; Supplier 2: *; Supplier Part Number 1: 77-VJ0603A471JXJCBC; Supplier Part Number 2: *; Package: 0603
C33-C35 = Cap_0603: MPN: 885012206071; MF: Würth Elektronik; Dielectric: X7R; Value: 100nF; Supplier 1: Mouser; Supplier 2: *; Supplier Part Number 1: 710-885012206071; Supplier Part Number 2: *; Package: 0603
C36 = Cap_0603: as C6 on sheet PowerSupply; Value: 100nF; Supplier 1: Mouser; Supplier 2: *; Supplier Part Number 1: 710-885012206071; Supplier Part Number 2: *; Package: 0603
D6 D7 = GBLCxx: Ultra Low Capacitance TVS Array; MPN: GBLC05CI-LF-T7; MF: ProTek Devices; standoff voltage: 5.0V; breakdown voltage: 6.0V; Package: SOD-323; Supplier 1: arrow; Supplier 2: futureelectronics; Supplier Part Number 1: *; Supplier Part Number 2: *; Model: GBLC05CI; ComponentLink1Description: Datasheet; ComponentLink1URL: https://static6.arrow.com/aropdfconversion/cf1b73a38d87e210bfa153441e03466b149f09ba/gblci.pdf
R16 R18 R22 R26 = R_0603: MPN: RE0603BRE0710KL; MF: Yageo; Value: 10k; Supplier 1: Mouser; Supplier Part Number 1: 603-RE0603BRE0710KL; Package: 0603
R17 R23 = R_0603: MPN: AC0603FR-13100RL; MF: Yageo; Tolerance: 1%; Value: 100R; Supplier 1: Mouser; Supplier Part Number 1: 603-AC0603FR-13100RL; Package: 0603
R19 R21 = R_0603: MPN: RC0603FR-1324R9L; MF: Yageo; Value: 24R9; Supplier 1: Mouser; Supplier Part Number 1: 603-RC0603FR-1324R9L; Package: 0603
R20 = R_1206: WID SMD 1M 5% 0,25W; MPN: APC1206B200RN; AN: 22757; possibleValue: 200R; Mixed: SMT; Preferred: Yes; MF: ARCOL/Ohmite; Case: 1206; Technology: TK100; Tolerance: 5%; Supplier 1: Mouser; Supplier Part Number 1: 284-APC1206B200RN; Value: dnp
R24 = R_0603: MPN: CRCW06030000Z0EBC; MF: Vishay / Dale; Value: 0R; Supplier 1: Mouser; Supplier Part Number 1: 71-CRCW06030000Z0EBC; Package: 0603
R25 R28 = R_0603: Value: dnp; Package: 0603
R27 R29 = R_0603: MPN: CRCW060310K0FKEAC; MF: Vishay / Dale; Value: 10k; Supplier 1: Mouser; Supplier Part Number 1: 71-CRCW060310K0FKEAC; Package: 0603
TP11-TP14 = 5006: as TP1 on sheet PowerSupply; Supplier 1: Mouser; Manufacturer Part Number: 5006; RoHS: Yes; Category: Connectors; Stock 1: 203116; Mount: PCB,Through Hole; Material: Nylon,Bronze,Silver; Contact Material: Bronze; Contact Plating: Tin,Silver; Color: Black; Housing Color: Black; Package Quantity: 100; Packaging: Bulk; Orientation: Straight; Length: 8.89mm; Height: 0.35inch; Lead Free: Lead Free; REACH SVHC: No SVHC; Flammability Rating: UL94 V-0; ComponentLink1URL: https://datasheet.ciiva.com/1123/m60-2p60-1123808.pdf?src-supplier=Newark; ComponentLink1Description: https://datasheet.ciiva.com/1123/m60-2p60-1123808.pdf?src-supplier=Newark; ComponentLink2URL: https://datasheet.ciiva.com/1454/1718283-1454829.pdf?src-supplier=Element14; ComponentLink2Description: https://datasheet.ciiva.com/1454/1718283-1454829.pdf?src-supplier=Element14; ComponentLink3URL: https://datasheet.ciiva.com/11744/0900766b8009b7c7-11744947.pdf?src-supplier=RSComponents; ComponentLink3Description: https://datasheet.ciiva.com/11744/0900766b8009b7c7-11744947.pdf?src-supplier=RSComponents; ComponentLink4URL: https://datasheet.ciiva.com/2917/m60-2p60-2917629.pdf?src-supplier=Digi-Key; ComponentLink4Description: https://datasheet.ciiva.com/2917/m60-2p60-2917629.pdf?src-supplier=Digi-Key; ComponentLink5URL: https://datasheet.ciiva.com/16883/70182825-16883963.pdf?src-supplier=Allied+Electronics; ComponentLink5Description: https://datasheet.ciiva.com/16883/70182825-16883963.pdf?src-supplier=Allied+Electronics; Supplier Part Number 1: 534-5006
U3 = LT6203_MSOP8: 2 Ch Low Noise, Low Power OpAmp; MPN: LT6203CMS8#PBF; MF: Analog Devices / Linear Technology; Created: Kreppel_20190830; Package: MSOP-8; Supplier 1: Mouser; Supplier Part Number 1: 584-LT6203CMS8#PBF
U4 = THS4521IDGKR: IC AMP RRO NEG OUT VLP 8VSSOP (Single Channel fully differential Amplifier); Manufacturer: Texas Instruments; Min Dual Supply Voltage: 1.5V; Max Dual Supply Voltage: 2.75V; Number of Channels: 1; Voltage Gain: 119dB; Slew Rate: 490V/µs; Max I/O Voltage: 2mV; Max Supply Voltage: 5.5V; Min Supply Voltage: 2.5V; Unity Gain Bandwidth Product: 95MHz; Common Mode Rejection Ratio: 80dB; Operating Supply Voltage: 5V; Bandwidth: 145MHz; Nominal Supply Current: 1.14mA; Input Bias Current: 900nA; Output Current per Channel: 55mA; Supplier 1: Mouser; Manufacturer Part Number: THS4521IDGKR; RoHS: Yes; Category: Amplifiers - Op Amps, Buffer, Instrumentation; Stock 1: 12114; Pricing 1: 1=2,55000, 10=2,29000, 25=2,16000, 100=1,78000, 250=1,59000, 500=1,54000, 1000=1,28000, 2500=1,25000, 1=2,83000, 10=2,54000, 25=2,40000, 100=1,98000, 250=1,77000, 500=1,71000 (EUR); Case/Package: VSSOP; Number of Pins: 8; Weight: 0.000935oz; Min Operating Temperature: -40°C; Max Operating Temperature: 85°C; Packaging: Tape and Reel; Package Quantity: 2500; -3db Bandwidth: 145MHz; Gain Bandwidth Product: 95MHz; Input Offset Voltage (Vos): 2mV; Operating Supply Current: 1.14mA; Power Supply Rejection Ratio (PSRR): 80dB; Number of Circuits: 1; Number of Elements: 1; Number of Amplifiers: 1; Radiation Hardening: No; Lead Free: Lead Free; REACH SVHC: No SVHC; ComponentLink1URL: https://datasheet.ciiva.com/14456/sbos458f-14456592.pdf?src-supplier=Avnet; ComponentLink1Description: https://datasheet.ciiva.com/14456/sbos458f-14456592.pdf?src-supplier=Avnet; ComponentLink2URL: https://datasheet.ciiva.com/18622/ths4521-18622155.pdf?src-supplier=Digi-Key; ComponentLink2Description: https://datasheet.ciiva.com/18622/ths4521-18622155.pdf?src-supplier=Digi-Key; ComponentLink3URL: https://datasheet.ciiva.com/18622/ths4521-18622156.pdf?src-supplier=Digi-Key; ComponentLink3Description: https://datasheet.ciiva.com/18622/ths4521-18622156.pdf?src-supplier=Digi-Key; ComponentLink4URL: https://datasheet.ciiva.com/18622/ths4521-18622157.pdf?src-supplier=Digi-Key; ComponentLink4Description: https://datasheet.ciiva.com/18622/ths4521-18622157.pdf?src-supplier=Digi-Key; Supplier Part Number 1: 595-THS4521IDGKR

## Nets that join several sheets
+5V: PCBdesign (R2.2), PowerSupply (8 pins), Amplifier (7 pins)
-5V: PCBdesign (J1.1 R3.1), PowerSupply (15 pins), Amplifier (C36.2 R25.1 U3.4)
conv_N: PCBdesign (J2.1 R1.2), PowerSupply (C1.1 L1.1 L3.1)
GND: PCBdesign (21 pins), PowerSupply (24 pins), Amplifier (13 pins)
ADC_IN_N: PCBdesign (J6.1), Amplifier (C29.2 C30.1 R21.2)
ADC_IN_P: PCBdesign (J7.1), Amplifier (C27.2 C29.1 R19.2)
ext_IN_N: PCBdesign (J3.1 J5.2), Amplifier (R17.1)
ext_IN_P: PCBdesign (J4.1 J5.1), Amplifier (R23.1)